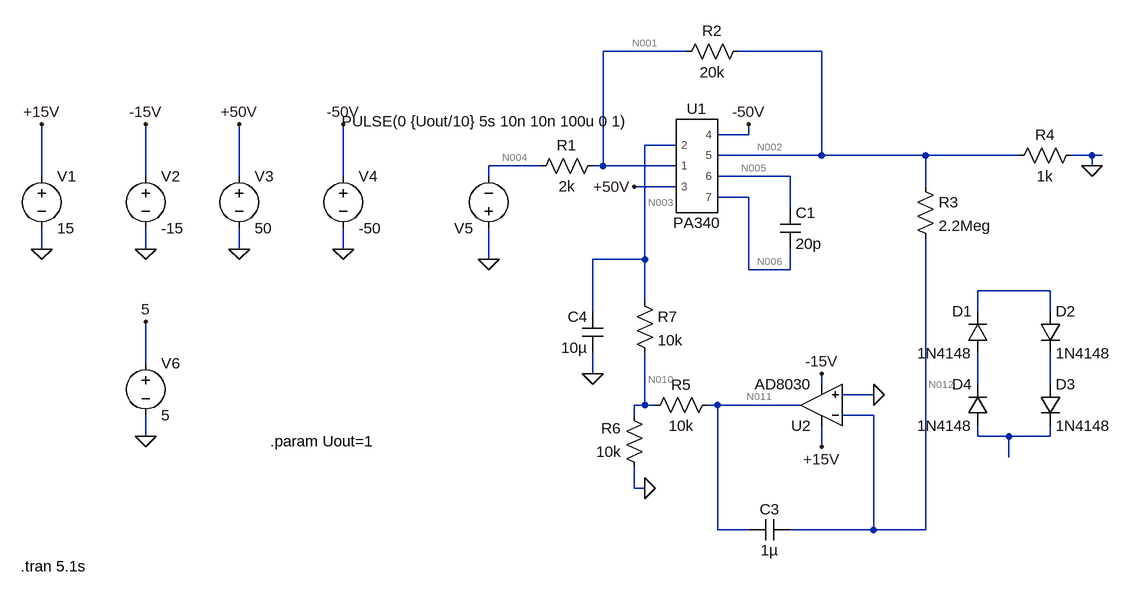
[diagram p0: schematic Draft2.asc]
Draft2.asc, the LTspice schematic file:
Version 4.1
SHEET 1 880 808
WIRE 112 0 -16 0
WIRE 320 0 192 0
WIRE 208 128 208 112
WIRE 208 128 160 128
WIRE 96 144 48 144
WIRE 320 160 320 0
WIRE 320 160 160 160
WIRE 480 160 320 160
WIRE 624 160 480 160
WIRE 736 160 704 160
WIRE 752 160 736 160
WIRE -112 176 -192 176
WIRE -16 176 -16 0
WIRE -16 176 -32 176
WIRE 96 176 -16 176
WIRE 736 176 736 160
WIRE -880 192 -880 112
WIRE -720 192 -720 112
WIRE -576 192 -576 112
WIRE -416 192 -416 112
WIRE -192 192 -192 176
WIRE 272 192 160 192
WIRE 96 208 32 208
WIRE 480 208 480 160
WIRE 208 224 160 224
WIRE 272 240 272 192
WIRE -880 304 -880 272
WIRE -720 304 -720 272
WIRE -576 304 -576 272
WIRE -416 304 -416 272
WIRE -192 320 -192 272
WIRE 48 320 48 144
WIRE 48 320 -32 320
WIRE 208 336 208 224
WIRE 272 336 272 304
WIRE 272 336 208 336
WIRE 672 368 560 368
WIRE 48 384 48 320
WIRE -32 400 -32 320
WIRE 560 400 560 368
WIRE 672 400 672 368
WIRE -720 480 -720 416
WIRE -32 496 -32 464
WIRE 320 512 320 496
WIRE 560 512 560 464
WIRE 672 512 672 464
WIRE 400 528 352 528
WIRE 48 544 48 464
WIRE 48 544 32 544
WIRE 64 544 48 544
WIRE 160 544 144 544
WIRE 288 544 160 544
WIRE 32 560 32 544
WIRE 400 560 352 560
WIRE -720 592 -720 560
WIRE 560 592 560 576
WIRE 608 592 560 592
WIRE 672 592 672 576
WIRE 672 592 608 592
WIRE 320 608 320 576
WIRE 608 624 608 592
WIRE 32 672 32 640
WIRE 48 672 32 672
WIRE 160 736 160 544
WIRE 208 736 160 736
WIRE 400 736 400 560
WIRE 400 736 272 736
WIRE 480 736 480 288
WIRE 480 736 400 736
FLAG -720 592 0
FLAG -880 304 0
FLAG -720 304 0
FLAG -576 304 0
FLAG -416 304 0
FLAG -880 112 +15V
FLAG 208 112 -50V
FLAG -720 112 -15V
FLAG 32 208 +50V
FLAG -576 112 +50V
FLAG -416 112 -50V
FLAG -720 416 5
FLAG -192 320 0
FLAG 320 496 -15V
FLAG 320 608 +15V
FLAG 48 672 0
FLAG -32 496 0
FLAG 400 528 0
FLAG 736 176 0
SYMBOL PA340 128 176 R0
SYMATTR InstName U1
SYMBOL voltage -880 176 R0
WINDOW 123 0 0 Left 0
WINDOW 39 0 0 Left 0
SYMATTR InstName V1
SYMATTR Value 15
SYMBOL voltage -720 176 R0
WINDOW 123 0 0 Left 0
WINDOW 39 0 0 Left 0
SYMATTR InstName V2
SYMATTR Value -15
SYMBOL voltage -576 176 R0
WINDOW 123 0 0 Left 0
WINDOW 39 0 0 Left 0
SYMATTR InstName V3
SYMATTR Value 50
SYMBOL voltage -416 176 R0
WINDOW 123 0 0 Left 0
WINDOW 39 0 0 Left 0
SYMATTR InstName V4
SYMATTR Value -50
SYMBOL voltage -720 464 R0
WINDOW 123 0 0 Left 0
WINDOW 39 0 0 Left 0
SYMATTR InstName V6
SYMATTR Value 5
SYMBOL cap 256 240 R0
SYMATTR InstName C1
SYMATTR Value 20p
SYMBOL res -16 160 R90
WINDOW 0 0 56 VBottom 2
WINDOW 3 32 56 VTop 2
SYMATTR InstName R1
SYMATTR Value 2k
SYMBOL res 208 -16 R90
WINDOW 0 0 56 VBottom 2
WINDOW 3 32 56 VTop 2
SYMATTR InstName R2
SYMATTR Value 20k
SYMBOL voltage -192 288 R180
WINDOW 3 -218 181 Left 2
WINDOW 123 0 0 Left 0
WINDOW 39 0 0 Left 0
SYMATTR InstName V5
SYMATTR Value PULSE(0 {Uout/10} 5s 10n 10n 100u 0 1)
SYMBOL res 464 192 R0
SYMATTR InstName R3
SYMATTR Value 2.2Meg
SYMBOL OpAmps\\AD8030 320 608 R180
SYMATTR InstName U2
SYMBOL cap 272 720 R90
WINDOW 0 0 32 VBottom 2
WINDOW 3 32 32 VTop 2
SYMATTR InstName C3
SYMATTR Value 1µ
SYMBOL res 160 528 R90
WINDOW 0 0 56 VBottom 2
WINDOW 3 32 56 VTop 2
SYMATTR InstName R5
SYMATTR Value 10k
SYMBOL res 48 656 R180
WINDOW 0 36 76 Left 2
WINDOW 3 36 40 Left 2
SYMATTR InstName R6
SYMATTR Value 10k
SYMBOL res 32 368 R0
SYMATTR InstName R7
SYMATTR Value 10k
SYMBOL cap -16 464 R180
WINDOW 0 24 56 Left 2
WINDOW 3 24 8 Left 2
SYMATTR InstName C4
SYMATTR Value 10µ
SYMBOL diode 576 464 R180
WINDOW 0 24 64 Left 2
WINDOW 3 24 0 Left 2
SYMATTR InstName D1
SYMATTR Value 1N4148
SYMBOL diode 656 400 R0
SYMATTR InstName D2
SYMATTR Value 1N4148
SYMBOL diode 656 512 R0
SYMATTR InstName D3
SYMATTR Value 1N4148
SYMBOL diode 576 576 R180
WINDOW 0 24 64 Left 2
WINDOW 3 24 0 Left 2
SYMATTR InstName D4
SYMATTR Value 1N4148
SYMBOL res 720 144 R90
WINDOW 0 0 56 VBottom 2
WINDOW 3 32 56 VTop 2
SYMATTR InstName R4
SYMATTR Value 1k
TEXT -528 600 Left 2 !.param Uout=1
TEXT -912 792 Left 2 !.tran 5.1s

The netlist it stands for:
* Draft2.asc
X§U1 N003 N001 +50V -50V N002 N005 N006 PA340  ; pins 2 1 3 4 5 6 7
V1 +15V 0 15
V2 -15V 0 -15
V3 +50V 0 50
V4 -50V 0 -50
V6 5 0 5
C1 N005 N006 20p
R1 N001 N004 2k
R2 N002 N001 20k
V5 0 N004 PULSE(0 {Uout/10} 5s 10n 10n 100u 0 1)
R3 N002 N012 2.2Meg
X§U2 0 N012 +15V -15V N011 AD8040  ; AD8030, pins In+ In- V+ V- OUT
C3 N012 N011 1µ
R5 N011 N010 10k
R6 0 N010 10k
R7 N003 N010 10k
C4 0 N003 10µ
D1 N008 N007 1N4148
D2 N007 N009 1N4148
D3 N009 N013 1N4148
D4 N013 N008 1N4148
R4 0 N002 1k
.model D D
.lib standard.dio
.param Uout=1
.tran 5.1s
.lib PA340_Pspice.LIB
.lib ADI.lib
.backanno
.end

* Results of the author's LTspice run, read from the files saved beside the schematic
* Operating Point, zero values left out:
*   V(n001) = -340.1 mV
*   V(-50v) = -50 V
*   V(n002) = -3.741 V
*   V(n006) = -4.053 V
*   V(5) = 5 V
*   V(n012) = 9.441 µV
*   V(n011) = -704.2 mV
*   V(n003) = -352.1 mV
*   V(+50v) = 50 V
*   V(n005) = 3.243 mV
*   V(+15v) = 15 V
*   V(-15v) = -15 V
*   V(n010) = -352.1 mV
*   I(R2) = -170 µA
*   I(R3) = -1.7 µA
*   I(R5) = -35.21 µA
*   I(C4) = -3.665 nA
*   I(R4) = 3.741 mA
*   I(V2) = 1.445 mA
*   I(V3) = -1.896 mA
*   I(R1) = -170 µA
*   I(V1) = -1.413 mA
*   I(V5) = 170 µA
*   I(R6) = 35.21 µA
*   I(R7) = -3.72 nA
*   I(V4) = 5.809 mA
*   I(C3) = -385.8 pA
*   Ix(u2:1) = -1.7 µA
*   Ix(u2:2) = -1.7 µA
*   Ix(u2:3) = 1.413 mA
*   Ix(u2:4) = -1.445 mA
*   Ix(u2:5) = 35.21 µA
*   Ix(u1:2) = 55 pA
*   Ix(u1:1) = 50 pA
*   Ix(u1:3) = 1.896 mA
*   Ix(u1:4) = -5.809 mA
*   Ix(u1:5) = 3.913 mA
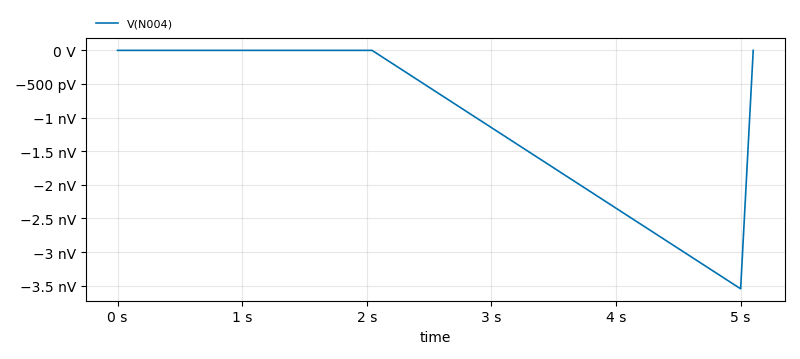
[diagram p1: Transient Analysis of Draft2.asc, plotted from the saved traces]
* Transient Analysis, 1 run:
*   V(N004): min -3.546 nV, max 0 V, average -1.063 nV, rms 1.942 nV, last 0 V